# EAGLE design lm3410-sepic-rgb-led-driver-22mm-mk-1 (EAGLE 6.5.0)
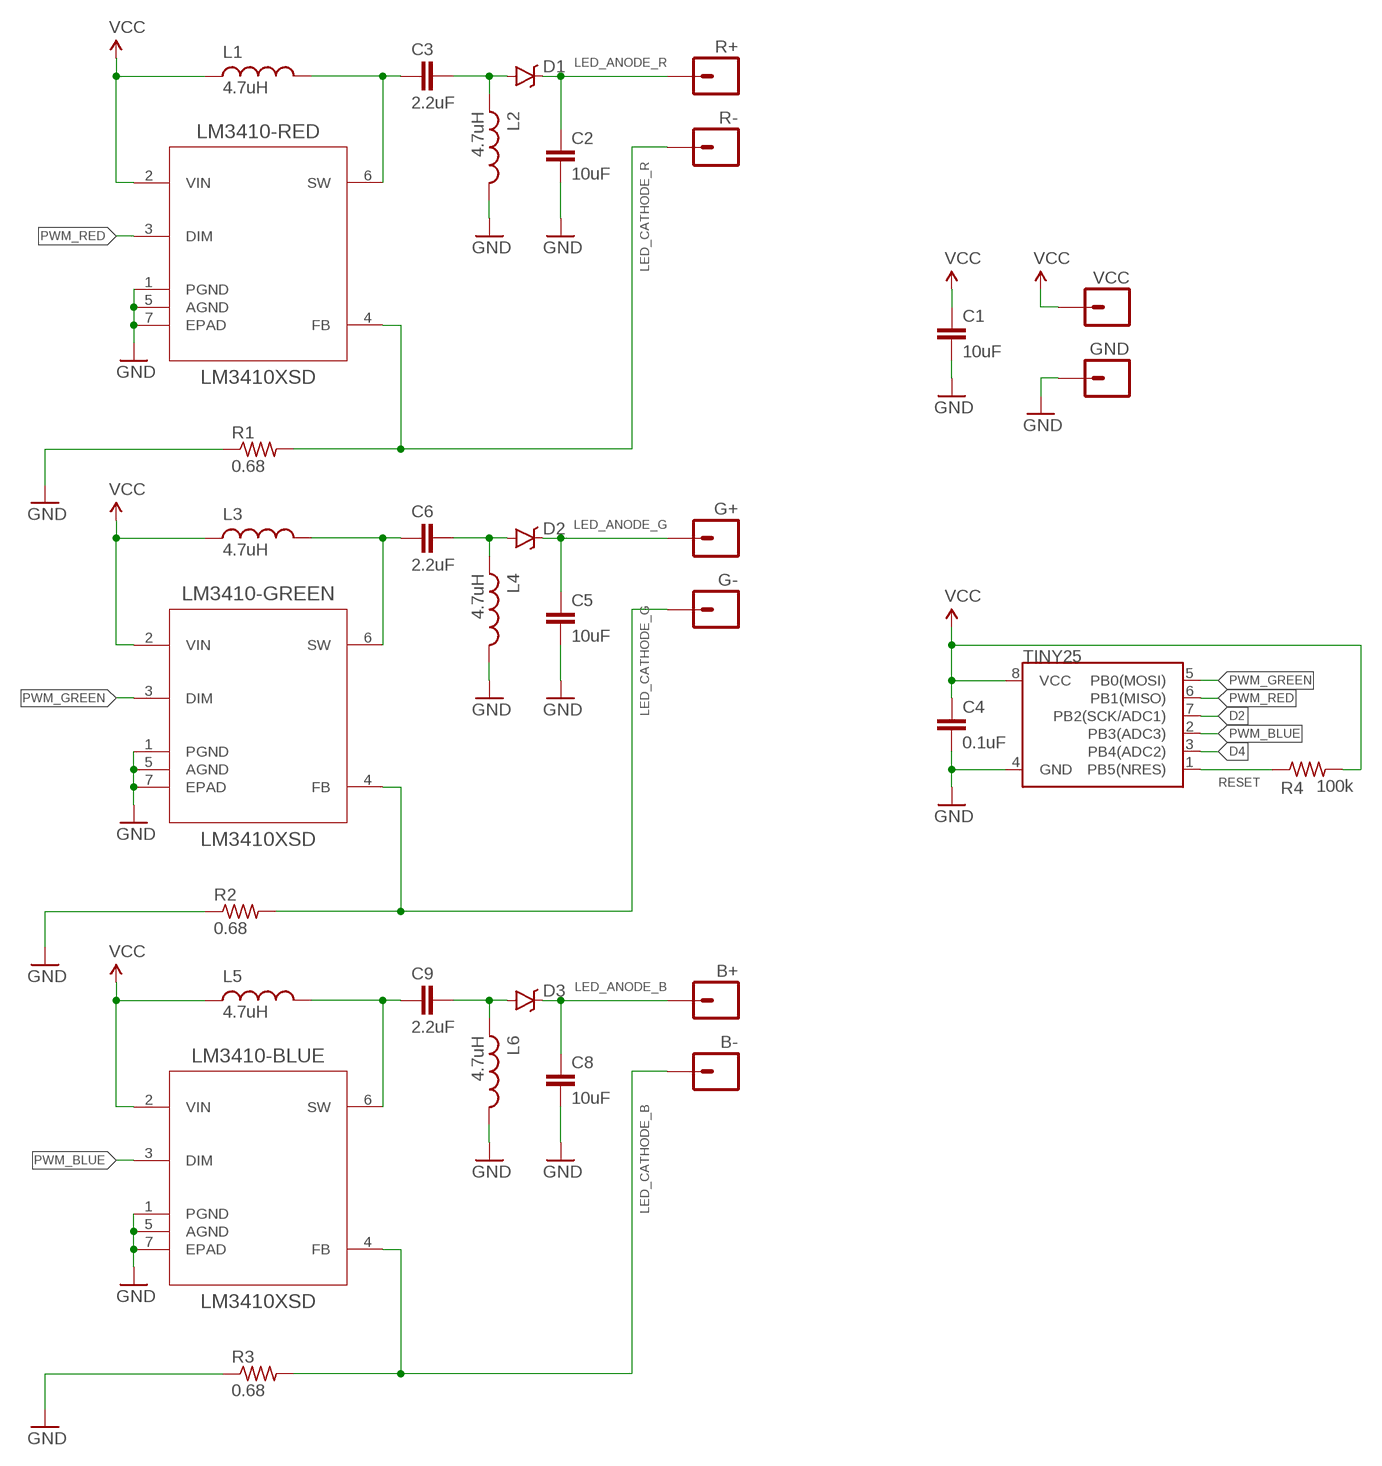
[diagram p0: schematic, sheet 1]

## Parts
B+  M01SMD_ANCHOR  [1X01_SMD_ANCHOR]
B-  M01SMD_ANCHOR  [1X01_SMD_ANCHOR]
C1  10uF  CAPACITOR-CERAMICC0603  [C0603]
C2  10uF  CAPACITOR-CERAMICC0603  [C0603]
C3  2.2uF  CAPACITOR-CERAMICC0603  [C0603]
C4  0.1uF  CAPACITOR-CERAMICC0402  [C0402]
C5  10uF  CAPACITOR-CERAMICC0603  [C0603]
C6  2.2uF  CAPACITOR-CERAMICC0603  [C0603]
C8  10uF  CAPACITOR-CERAMICC0603  [C0603]
C9  2.2uF  CAPACITOR-CERAMICC0603  [C0603]
D1  PMEG4005EJ  DIODE-SCHOTTKY-PMEG4005EJ  [SOD-323]
D2  PMEG4005EJ  DIODE-SCHOTTKY-PMEG4005EJ  [SOD-323]
D3  PMEG4005EJ  DIODE-SCHOTTKY-PMEG4005EJ  [SOD-323]
G+  M01SMD_ANCHOR  [1X01_SMD_ANCHOR]
G-  M01SMD_ANCHOR  [1X01_SMD_ANCHOR]
GND  M01NOT-A-VIA-NOPE  [1X01_NOSILK_NOSTOP]
L1  4.7uH  INDUCTORIFSC-0806  [INDUCTOR_2X1.6MM]
L2  4.7uH  INDUCTORIFSC-0806  [INDUCTOR_2X1.6MM]
L3  4.7uH  INDUCTORIFSC-0806  [INDUCTOR_2X1.6MM]
L4  4.7uH  INDUCTORIFSC-0806  [INDUCTOR_2X1.6MM]
L5  4.7uH  INDUCTORIFSC-0806  [INDUCTOR_2X1.6MM]
L6  4.7uH  INDUCTORIFSC-0806  [INDUCTOR_2X1.6MM]
LM3410-BLUE  LM3410XSD  [DFN300X300X80-7N]
LM3410-GREEN  LM3410XSD  [DFN300X300X80-7N]
LM3410-RED  LM3410XSD  [DFN300X300X80-7N]
R1  0.68  RESISTORR0805  [R0805]
R2  0.68  RESISTORR0805  [R0805]
R3  0.68  RESISTORR0805  [R0805]
R4  100k  RESISTORR0402  [R0402]
R+  M01SMD_ANCHOR  [1X01_SMD_ANCHOR]
R-  M01SMD_ANCHOR  [1X01_SMD_ANCHOR]
TINY25  ATTINY45TINY25-20-SOICN  [SO08]
VCC  M01NOT-A-VIA-NOPE  [1X01_NOSILK_NOSTOP]

## Nets
D2: TINY25.7(PB2(SCK/ADC1))
D4: TINY25.3(PB4(ADC2))
GND: C1.2 C2.2 C4.2 C5.2 C8.2 GND.P$1 L2.P$2 L4.P$2 L6.P$2 LM3410-BLUE.1(PGND) LM3410-BLUE.5(AGND) LM3410-BLUE.7(EPAD) LM3410-GREEN.1(PGND) LM3410-GREEN.5(AGND) LM3410-GREEN.7(EPAD) LM3410-RED.1(PGND) LM3410-RED.5(AGND) LM3410-RED.7(EPAD) R1.1 R2.1 R3.1 TINY25.4(GND)
LED_ANODE_B: B+.P$1 C8.1 D3.C
LED_ANODE_G: C5.1 D2.C G+.P$1
LED_ANODE_R: C2.1 D1.C R+.P$1
LED_CATHODE_B: B-.P$1 LM3410-BLUE.4(FB) R3.2
LED_CATHODE_G: G-.P$1 LM3410-GREEN.4(FB) R2.2
LED_CATHODE_R: LM3410-RED.4(FB) R1.2 R-.P$1
N$1: C3.2 D1.A L2.P$1
N$2: C6.2 D2.A L4.P$1
N$5: C9.2 D3.A L6.P$1
PWM_BLUE: LM3410-BLUE.3(DIM) TINY25.2(PB3(ADC3))
PWM_GREEN: LM3410-GREEN.3(DIM) TINY25.5(PB0(MOSI))
PWM_RED: LM3410-RED.3(DIM) TINY25.6(PB1(MISO))
RESET: R4.1 TINY25.1(PB5(NRES))
SW: C3.1 L1.P$2 LM3410-RED.6(SW)
SW1: C6.1 L3.P$2 LM3410-GREEN.6(SW)
SW2: C9.1 L5.P$2 LM3410-BLUE.6(SW)
VCC: C1.1 C4.1 L1.P$1 L3.P$1 L5.P$1 LM3410-BLUE.2(VIN) LM3410-GREEN.2(VIN) LM3410-RED.2(VIN) R4.2 TINY25.8(VCC) VCC.P$1

## Library data of the parts
B+ B- G+ G- GND R+ R- VCC = A_butts:M01: Header 1 Standard 1-pin 0.1" header. Use with straight break away headers (SKU : PRT-00116), right angle break away headers (PRT-00553), swiss pins (PRT-00743), machine pins (PRT-00117), and female headers (PRT-00115).
C1-C6 C8 C9 = A_butts:CAPACITOR-CERAMIC: CAPACITOR, European symbol
D1-D3 = A_butts:DIODE-SCHOTTKY: Schottky diodes in SFE's production catalog BAT20J 1A 23V 0.62Vf RB751 120mA 40V 0.37Vf PMEG4005EJ 0.5A 40V 0.42Vf MBRA140 1A 40V 0.5Vf B340A 3A 40V SMA; PROD_ID: DIO-10955
L1-L6 = A_butts:INDUCTOR: Inductors Basic Inductor/Choke - 0603 and 1206. Footprints are not proven and vary greatly between part numbers. SRN6045- 33uH, 20% 1.4A SDR0403-560KL - 56uH, 10%, 500mA RMS/740mA peak
LM3410-BLUE LM3410-GREEN LM3410-RED = A_butts:LM3410XSD: Constant Current Boost and SEPIC LED Driver; MPN: LM3410XSD; OC_FARNELL: -; OC_NEWARK: 11N9218; PACKAGE: DFN-6; SUPPLIER: National Semiconductor
R1-R4 = A_butts:RESISTOR: RESISTOR, American symbol
TINY25 = A_butts:ATTINY45: Atmel 8-pin 2/4/8kB flash uC

## Board
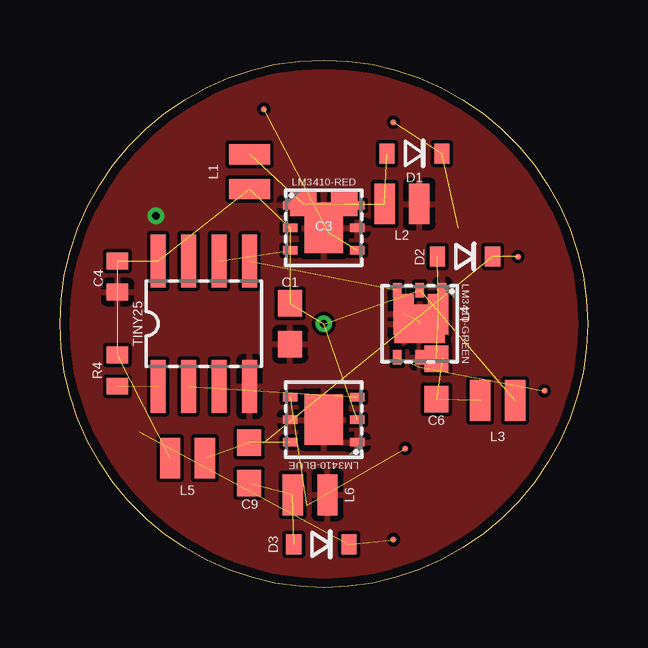
[diagram p1: board, top side]
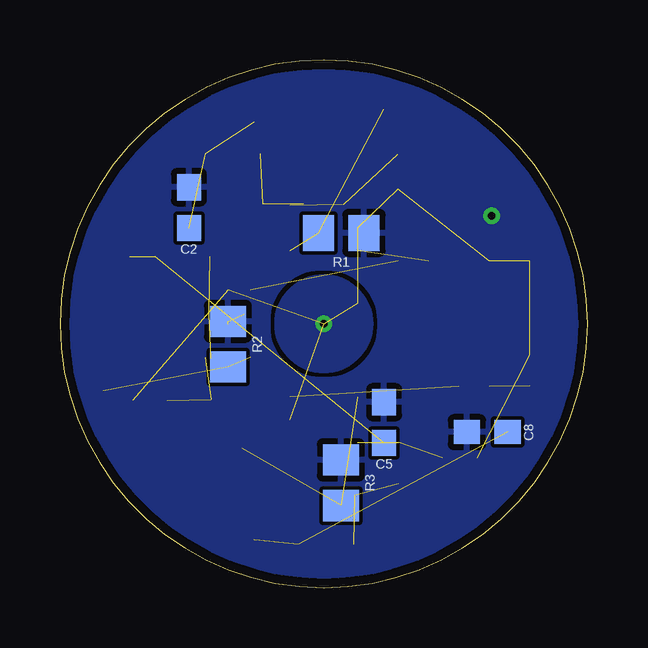
[diagram p2: board, bottom side, seen from below]

Size 22 x 22 mm. Coordinates in mm from the lower left corner, seen from the top.
Outline: 11,0 arc-90 0,11 arc-90 11,22 arc-90 22,11 arc-90 11,0
Copper layers (1*16): Top 0.0356mm / dielectric 1.5011mm / Bottom 0.0356mm
Design rules "LaenPCBOrder2": minimum track width 6mil, minimum drill 13mil, track to track 6mil, track to pad 6mil, pad to pad 6mil, via to via 6mil, smd to smd 6mil, copper to edge 15mil, drill to drill 6mil, minimum pad ring 7mil, minimum via ring 7mil, stop-mask expansion 3mil, vias tented up to drill 20mil, thermal gap 10mil

### Footprints (pad centres in the part's own frame; a part is rotated, then mirrored left to right if it is on the bottom)
1X01_SMD_ANCHOR = smd 0.254 x 0.254: P$1 0,0
C0603 = smd 1.1 x 1: 1 -0.85,0; 2 0.85,0
C0402 = smd 0.7 x 0.9: 1 -0.65,0; 2 0.65,0
SOD-323 = smd 0.63 x 0.83: A 1.15,0; C -1.15,0
1X01_NOSILK_NOSTOP = drill 0.33: P$1 0,0
INDUCTOR_2X1.6MM = smd 0.85 x 1.7: P$1 -0.725,0; P$2 0.725,0
DFN300X300X80-7N = smd 0.61 x 0.356: 1 -1.397,0.94; 2 -1.397,0; 3 -1.397,-0.94; 4 1.397,-0.94; 5 1.397,0; 6 1.397,0.94 | smd 1.6 x 2.108: 7 0,0
R0805 = smd 1.3 x 1.5: 1 -0.95,0; 2 0.95,0
R0402 = smd 0.7 x 0.9: 1 -0.65,0; 2 0.65,0
SO08 = smd 0.61 x 2.21: 1 -1.905,-2.616; 2 -0.635,-2.616; 3 0.635,-2.616; 4 1.905,-2.616; 5 1.905,2.616; 6 0.635,2.616; 7 -0.635,2.616; 8 -1.905,2.616

### Placement (x,y rotation side)
B+  13.9,2 0 top
B-  14.4,5.8 0 top
C1  9.6,11 270 top
C2  16.62,15.84 90 bottom
C3  11,16 0 top
C4  2.4,12.97 270 top
C5  8.48,6.88 90 bottom
C6  15.7,8.7 90 top
C8  4.18,6.48 180 bottom
C9  7.88,5.2 270 top
D1  14.78,18.1 180 top
D2  16.89,13.8 180 top
D3  10.9,1.8 180 top
G+  19.1,13.8 0 top
G-  20.2,8.2 0 top
GND  4,15.5 0 top
L1  7.9,17.34 90 top
L2  14.26,16 0 top
L3  18.25,7.8 180 top
L4  15.05,11.4 180 top
L5  5.32,5.4 0 top
L6  10.43,3.87 0 top
LM3410-BLUE  11,7 180 top
LM3410-GREEN  15,11 270 top
LM3410-RED  11,15 0 top
R1  10.27,14.79 180 bottom
R2  14.99,10.15 270 bottom
R3  10.29,4.37 270 bottom
R4  2.4,9.05 90 top
R+  13.9,19.4 0 top
R-  8.5,19.94 90 top
TINY25  6,11 0 top
VCC  11,11 0 top

### Tracks (layer width: path | path; a pad name or v marks a point on that pad's centre or on a via)
GND  (2 unrouted)
  pour Bottom (rank 6): 11,0 arc-90 0,11 arc-90 11,22 arc-90 22,11 arc-90
  pour Top (rank 6): 11,0 arc-90 0,11 arc-90 11,22 arc-90 22,11 arc-90
LED_ANODE_B  (2 unrouted)
LED_ANODE_G  (2 unrouted)
LED_ANODE_R  (2 unrouted)
LED_CATHODE_B  (2 unrouted)
LED_CATHODE_G  (2 unrouted)
LED_CATHODE_R  (2 unrouted)
N$1  (2 unrouted)
N$2  (2 unrouted)
N$5  (2 unrouted)
PWM_BLUE  (1 unrouted)
PWM_GREEN  (1 unrouted)
PWM_RED  (1 unrouted)
RESET  (1 unrouted)
SW  (2 unrouted)
SW1  (2 unrouted)
SW2  (2 unrouted)
VCC  (10 unrouted)
  pour Bottom: 13,11 arc-90 11,9 arc-90 9,11 arc-90 11,13 arc-90